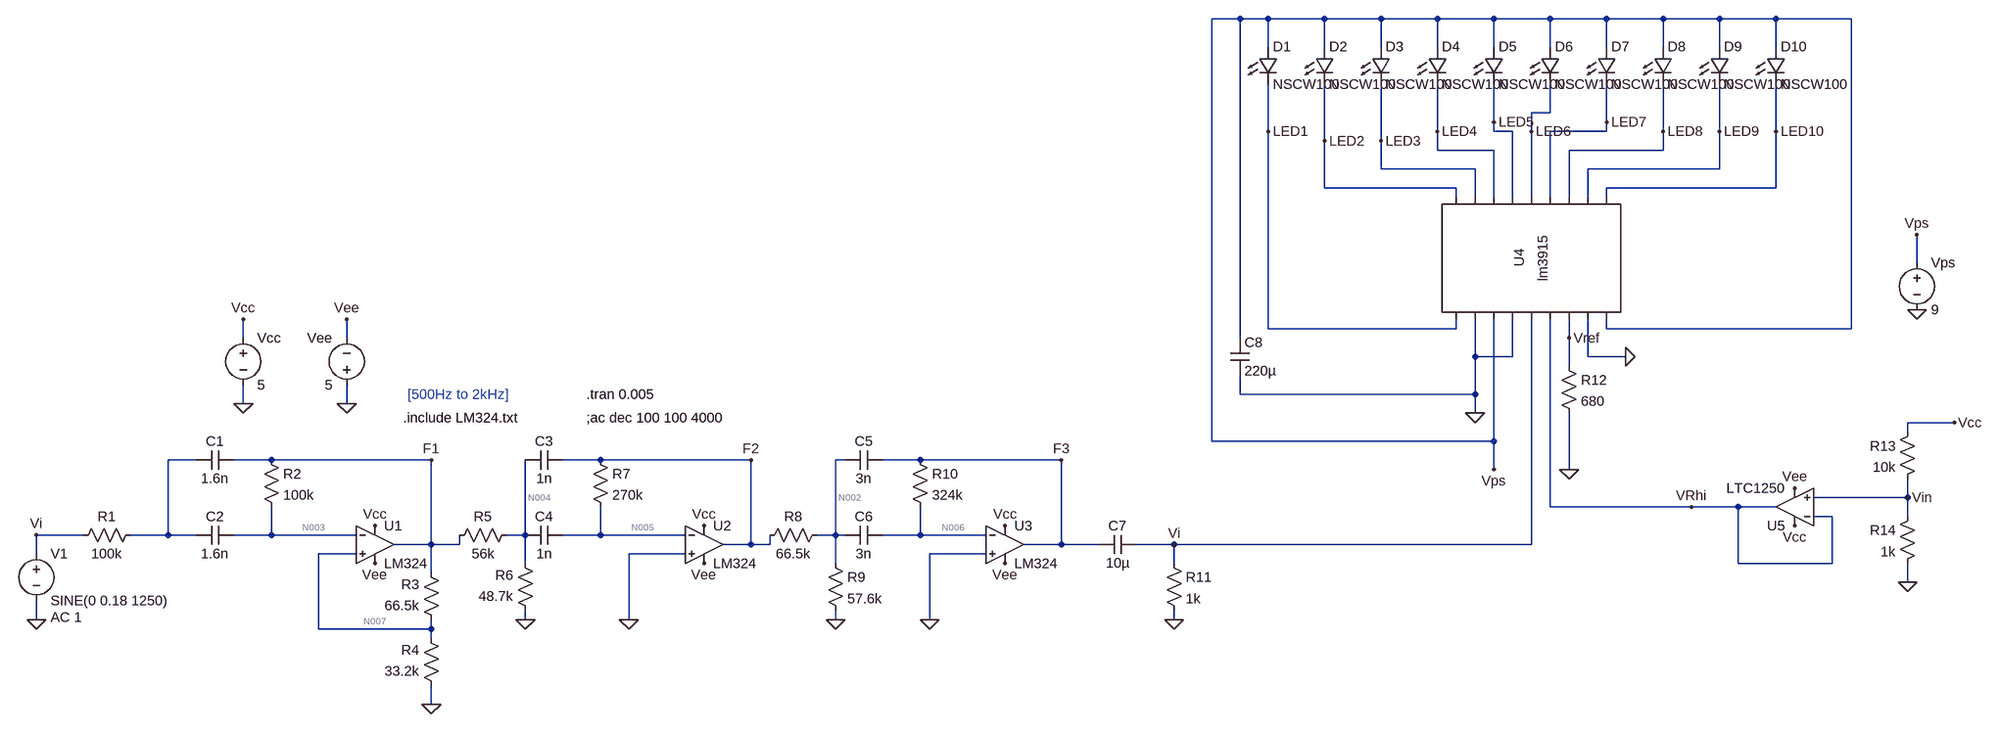
[diagram p0: schematic FinalMidrangeFilterWithLEDDriver.asc]
* FinalMidrangeFilterWithLEDDriver.asc
R1 N001 Vi 100k
V1 Vi 0 SINE(0 0.18 1250) AC 1
R2 F1 N003 100k
R5 N004 F1 56k
R6 0 N004 48.7k
R7 F2 N005 270k
R8 F2 N002 66.5k
R9 N002 0 57.6k
R10 F3 N006 324k
C1 F1 N001 1.6n
C2 N003 N001 1.6n
C3 F2 N004 1n
C4 N005 N004 1n
C5 F3 N002 3n
C6 N006 N002 3n
R3 N007 F1 66.5k
R4 0 N007 33.2k
Vcc Vcc 0 5
Vee 0 Vee 5
XU1 N007 N003 Vcc Vee F1 LM324  ; pins In+ In- V+ V- OUT
XU2 0 N005 Vcc Vee F2 LM324  ; pins In+ In- V+ V- OUT
XU3 0 N006 Vcc Vee F3 LM324  ; pins In+ In- V+ V- OUT
C7 Vi F3 10µ
R11 Vi 0 1k
D1 Vps LED1 NSCW100
D2 Vps LED2 NSCW100
D3 Vps LED3 NSCW100
D4 Vps LED4 NSCW100
D5 Vps LED5 NSCW100
D6 Vps LED6 NSCW100
D7 Vps LED7 NSCW100
D8 Vps LED8 NSCW100
D9 Vps LED9 NSCW100
D10 Vps LED10 NSCW100
C8 Vps 0 220µ
Vps Vps 0 9
* U4: lm3915 (symbol AutoGenerated\lm3915 not available, pins judged from their places): pin1=LED1 pin2=0 pin3=Vps pin4=0 pin5=Vi pin6=VRhi pin7=Vref pin8=0 pin9=Vps pin10=LED2 pin11=LED3 pin12=LED4 pin13=LED5 pin14=LED6 pin15=LED7 pin16=LED8 pin17=LED9 pin18=LED10
R12 Vref 0 680
R13 Vcc Vin 10k
R14 Vin 0 1k
XU5 Vin VRhi Vcc Vee VRhi LTC1250  ; pins In+ In- V+ V- OUT
.model D D
.lib standard.dio
.tran 0.005
;ac dec 100 100 4000
* [500Hz to 2kHz]
.include LM324.txt
.backanno
.end

* Results of the author's LTspice run, read from the files saved beside the schematic
* Operating Point, zero values left out:
*   V(f1) = -2.379 mV
*   V(n003) = -384.5 µV
*   V(n004) = -1.107 mV
*   V(f2) = -5.419 mV
*   V(n005) = -33.6 µV
*   V(n002) = -2.515 mV
*   V(f3) = -6.496 mV
*   V(n006) = -33.59 µV
*   V(n007) = -350.9 µV
*   V(vcc) = 5 V
*   V(vee) = -5 V
*   V(vps) = 9 V
*   V(led1) = 7.98 V
*   V(led2) = 7.98 V
*   V(led3) = 7.98 V
*   V(led4) = 7.98 V
*   V(led5) = 7.98 V
*   V(led6) = 7.98 V
*   V(led7) = 7.98 V
*   V(led8) = 7.98 V
*   V(led9) = 7.98 V
*   V(led10) = 7.98 V
*   V(vref) = 1.192 V
*   V(vrhi) = 454.5 mV
*   V(vin) = 454.5 mV
*   I(D10) = 1 µA
*   I(D9) = 1 µA
*   I(D8) = 1 µA
*   I(D7) = 1 µA
*   I(D6) = 1 µA
*   I(D5) = 1 µA
*   I(D4) = 1 µA
*   I(D3) = 1 µA
*   I(D2) = 1 µA
*   I(D1) = 1 µA
*   I(R14) = 454.5 µA
*   I(R13) = 454.5 µA
*   I(R12) = 1.753 mA
*   I(R4) = 10.57 nA
*   I(R3) = 30.5 nA
*   I(R10) = -19.94 nA
*   I(R9) = -43.66 nA
*   I(R8) = -43.66 nA
*   I(R7) = -19.94 nA
*   I(R6) = 22.72 nA
*   I(R5) = 22.72 nA
*   I(R2) = -19.94 nA
*   I(Vps) = -10.45 mA
*   I(Vee) = -4.012 mA
*   I(Vcc) = -4.483 mA
*   I(V1) = -25 nA
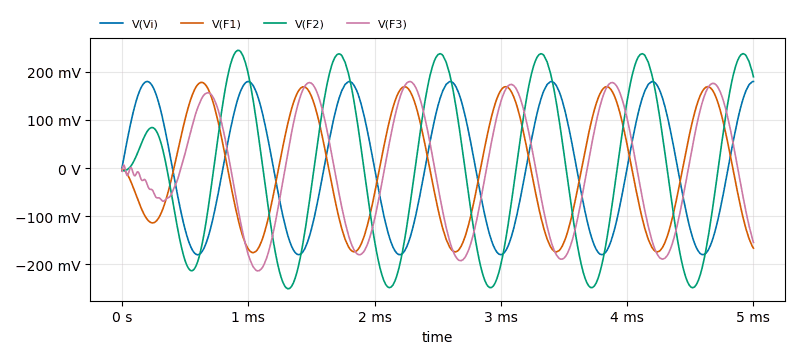
[diagram p1: Transient Analysis of FinalMidrangeFilterWithLEDDriver.asc, plotted from the saved traces]
* Transient Analysis, 1 run:
*   V(Vi): min -180 mV, max 180 mV, average 4.565 mV, rms 127.2 mV, last 180 mV
*   V(F1): min -175.7 mV, max 178.1 mV, average -1.073 mV, rms 118.4 mV, last -166.4 mV
*   V(F2): min -250.8 mV, max 244.7 mV, average -1.753 mV, rms 166 mV, last 189.8 mV
*   V(F3): min -213.6 mV, max 179.9 mV, average -3.734 mV, rms 123.2 mV, last -154.5 mV